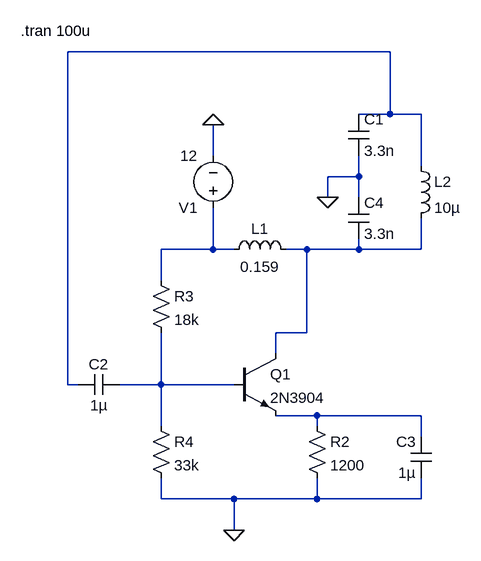
[diagram p0: schematic ColpittsOscilator.asc]
ColpittsOscilator.asc, the LTspice schematic file:
Version 4
SHEET 1 880 680
WIRE 192 -288 -304 -288
WIRE 192 -192 192 -288
WIRE 192 -192 144 -192
WIRE 240 -192 192 -192
WIRE -80 -128 -80 -176
WIRE 240 -112 240 -192
WIRE 144 -96 144 -128
WIRE 144 -96 96 -96
WIRE 96 -64 96 -96
WIRE 144 -64 144 -96
WIRE -80 16 -80 -48
WIRE -80 16 -160 16
WIRE -48 16 -80 16
WIRE 64 16 32 16
WIRE 144 16 144 0
WIRE 144 16 64 16
WIRE 240 16 240 -32
WIRE 240 16 144 16
WIRE -160 64 -160 16
WIRE 64 144 64 16
WIRE 64 144 16 144
WIRE 16 176 16 144
WIRE -304 224 -304 -288
WIRE -288 224 -304 224
WIRE -160 224 -160 144
WIRE -160 224 -224 224
WIRE -48 224 -160 224
WIRE 80 272 16 272
WIRE 240 272 80 272
WIRE -160 288 -160 224
WIRE 80 288 80 272
WIRE 240 304 240 272
WIRE -160 400 -160 368
WIRE -48 400 -160 400
WIRE 80 400 80 368
WIRE 80 400 -48 400
WIRE 240 400 240 368
WIRE 240 400 80 400
WIRE -48 448 -48 400
FLAG -48 448 0
FLAG -80 -176 0
FLAG 96 -64 0
SYMBOL voltage -80 -32 R180
WINDOW 123 0 0 Left 0
WINDOW 39 0 0 Left 0
SYMATTR InstName V1
SYMATTR Value 12
SYMBOL res 64 272 R0
SYMATTR InstName R2
SYMATTR Value 1200
SYMBOL res -176 48 R0
SYMATTR InstName R3
SYMATTR Value 18k
SYMBOL res -176 272 R0
SYMATTR InstName R4
SYMATTR Value 33k
SYMBOL npn -48 176 R0
SYMATTR InstName Q1
SYMATTR Value 2N3904
SYMBOL cap -224 208 R90
WINDOW 0 0 32 VBottom 2
WINDOW 3 32 32 VTop 2
SYMATTR InstName C2
SYMATTR Value 1µ
SYMBOL cap 256 368 R180
WINDOW 0 24 56 Left 2
WINDOW 3 24 8 Left 2
SYMATTR InstName C3
SYMATTR Value 1µ
SYMBOL ind -64 32 R270
WINDOW 0 32 56 VTop 2
WINDOW 3 5 56 VBottom 2
SYMATTR InstName L1
SYMATTR Value 0.159
SYMBOL ind 224 -128 R0
SYMATTR InstName L2
SYMATTR Value 10µ
SYMBOL cap 128 -192 R0
SYMATTR InstName C1
SYMATTR Value 3.3n
SYMBOL cap 128 -64 R0
SYMATTR InstName C4
SYMATTR Value 3.3n
TEXT -376 -320 Left 2 !.tran 100u

The netlist it stands for:
* ColpittsOscilator.asc
V1 N002 0 12
R2 N005 0 1200
R3 N002 N004 18k
R4 N004 0 33k
Q1 N003 N004 N005 0 2N3904
C2 N004 N001 1µ
C3 0 N005 1µ
L1 N002 N003 0.159
L2 N001 N003 10µ
C1 N001 0 3.3n
C4 0 N003 3.3n
.model NPN NPN
.model PNP PNP
.lib standard.bjt
.tran 100u
.backanno
.end